# EAGLE design day-led-r1 (EAGLE 6.5.0)
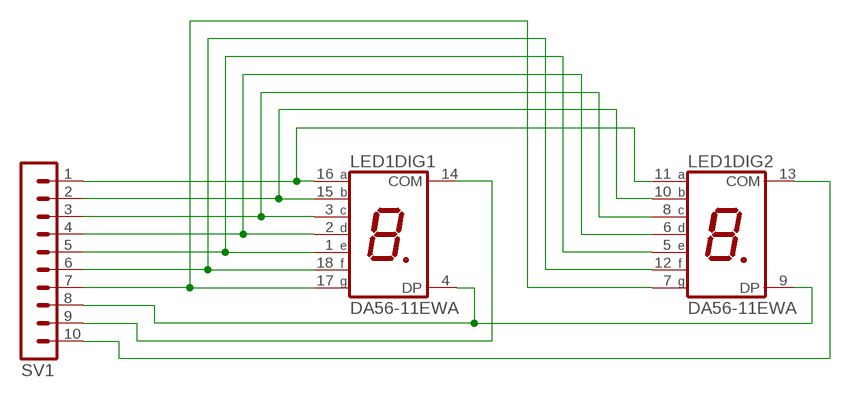
[diagram p0: schematic, sheet 1]

## Parts
LED1  DA56-11EWA  [DA56]
SV1  MA10-1W  [MA10-1W]

## Nets
N$1: LED1.11(DIG2:A) LED1.16(DIG1:A) SV1.1
N$2: LED1.10(DIG2:B) LED1.15(DIG1:B) SV1.2
N$3: LED1.3(DIG1:C) LED1.8(DIG2:C) SV1.3
N$4: LED1.2(DIG1:D) LED1.6(DIG2:D) SV1.4
N$5: LED1.1(DIG1:E) LED1.5(DIG2:E) SV1.5
N$6: LED1.12(DIG2:F) LED1.18(DIG1:F) SV1.6
N$7: LED1.7(DIG2:G) LED1.17(DIG1:G) SV1.7
N$8: LED1.4(DIG1:DP) LED1.9(DIG2:DP) SV1.8
N$17: LED1.13(DIG2:COM) SV1.10
N$20: LED1.14(DIG1:COM) SV1.9

## Library data of the parts
LED1 = display-kingbright:DA56-11: 14.22mm (0.56INCH) DUAL DIGIT NUMERIC DISPLAYS Source: www.kingbright.com .. DA56-11SRWA.pdf; OC_FARNELL: unknown; OC_NEWARK: unknown
SV1 = con-lstb:MA10-1W: PIN HEADER; OC_FARNELL: unknown; OC_NEWARK: unknown

## Board
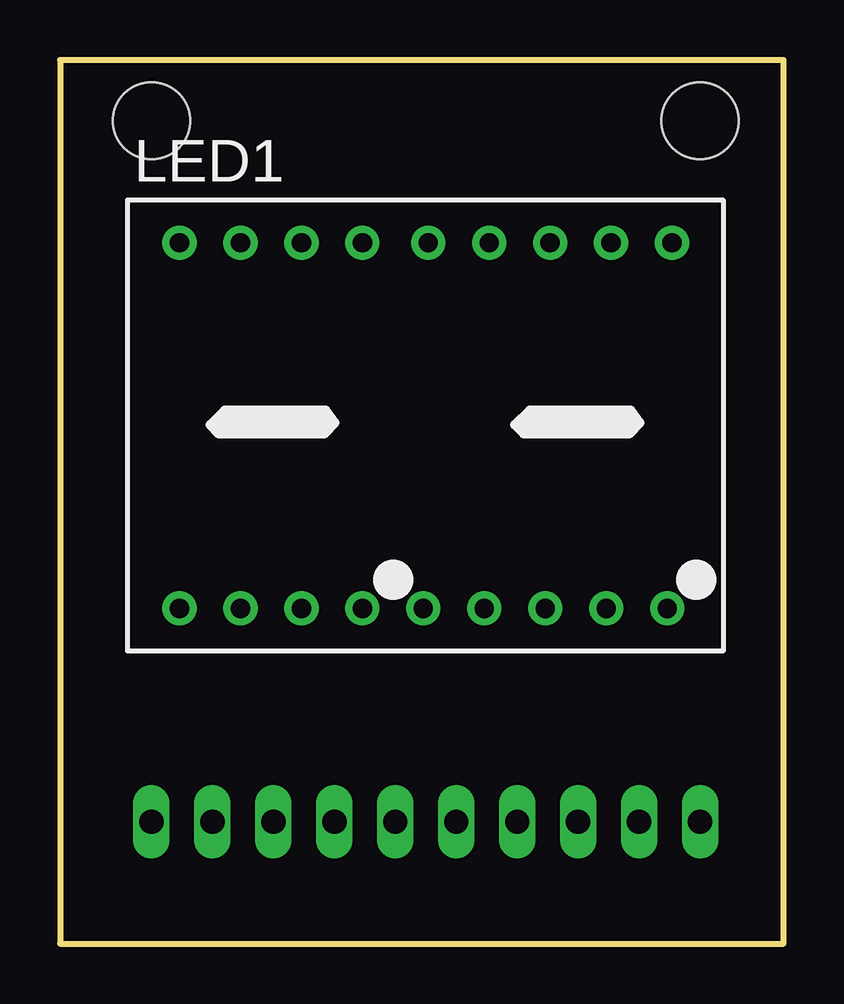
[diagram p1: board, top side]
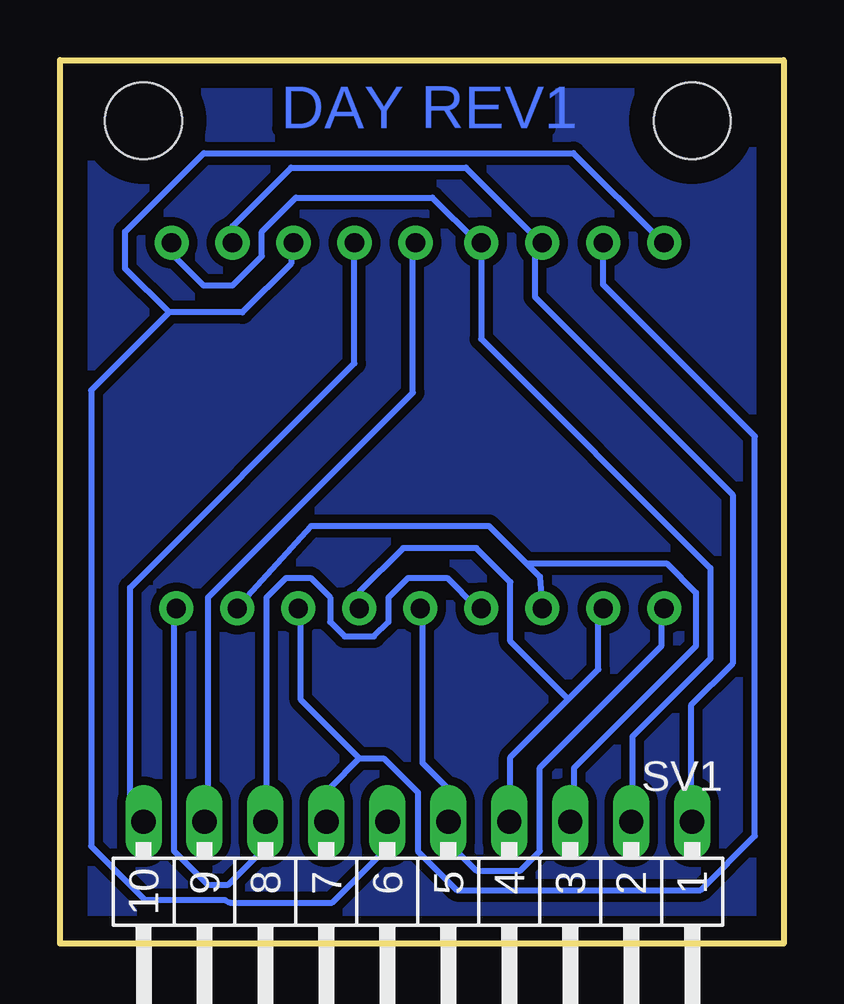
[diagram p2: board, bottom side, seen from below]

Size 30.15 x 36.82 mm. Coordinates in mm from the lower left corner, seen from the top.
Outline: 0,0 30.15,0 30.15,36.82 0,36.82 0,0
Copper layers (1*16): Top 0.035mm / dielectric 1.5mm / Bottom 0.035mm
Design rules "default *": minimum track width 10mil, minimum drill 24mil, track to track 14mil, track to pad 14mil, pad to pad 14mil, via to via 14mil, smd to smd 14mil, copper to edge 40mil, drill to drill 8mil, minimum pad ring 10mil, minimum via ring 8mil, stop-mask expansion 4mil, vias tented up to drill 0mil, thermal gap 10mil
Holes 3.2 mm at 3.81,34.29 26.67,34.29

### Footprints (pad centres in the part's own frame; a part is rotated, then mirrored left to right if it is on the bottom)
DA56 = drill 0.8 pad 1.422: 1 -10.26,-7.62; 2 -7.72,-7.62; 3 -5.18,-7.62; 4 -2.64,-7.62; 5 -0.1,-7.62; 6 2.44,-7.62; 7 4.98,-7.62; 8 7.52,-7.62; 9 10.06,-7.62; 10 10.26,7.62; 11 7.72,7.62; 12 5.18,7.62; 13 2.64,7.62; 14 0.1,7.62; 15 -2.64,7.62; 16 -5.18,7.62; 17 -7.72,7.62; 18 -10.26,7.62
MA10-1W = drill 1.016 long: 1 -11.43,0; 2 -8.89,0; 3 -6.35,0; 4 -3.81,0; 5 -1.27,0; 6 1.27,0; 7 3.81,0; 8 6.35,0; 9 8.89,0; 10 11.43,0

### Placement (x,y rotation side)
LED1  15.24,21.59 0 top
SV1  15.24,5.08 180 bottom

### Tracks (layer width: path | path; a pad name or v marks a point on that pad's centre or on a via)
N$1
  Bottom 0.254: 10.36,29.46 13.23,32.33 20.52,32.33 22.96,29.9 LED1.11 | 10.36,29.46 10.16,29.26 LED1.16 10.36,29.46 | 10.36,29.46 10.36,26.95 2.12,18.71 2.12,11.67 3.86,9.93 3.86,5.08 SV1.1
N$2
  Bottom 0.254: LED1.10 25.4,29.06 25.4,28.65 24.18,27.43 22.96,27.43 21.74,28.65 21.74,29.67 20.32,31.09 14.63,31.09 12.8,29.26 LED1.15 12.6,29.06 12.6,25.2 3.05,15.65 3.05,11.87 6.3,8.62 6.3,5.08 SV1.2
N$3
  Bottom 0.254: 10.72,15.85 12.28,17.41 19.68,17.41 22.76,14.02 LED1.8 | 10.72,15.85 10.16,15.29 LED1.3 | 10.72,15.85 4.88,15.85 3.66,14.63 3.66,12.39 8.74,7.32 8.74,5.08 SV1.3
N$4
  Bottom 0.254: 8.97,10.19 11.38,7.77 11.38,5.08 SV1.4 | 8.97,10.19 7.72,11.43 7.72,13.82 LED1.2 | 8.97,10.19 11.38,12.6 11.38,15.06 12.8,16.48 15.85,16.48 17.68,14.66 LED1.6
N$5
  Bottom 0.254: LED1.1 5.08,13.82 5.08,12.42 10.16,7.34 10.16,3.86 10.97,3.05 12.8,3.05 13.82,4.06 13.82,5.08 SV1.5 14.02,5.08 14.02,6.5 15.04,7.52 15.04,13.82 LED1.5
N$6
  Bottom 0.254: 25.6,26.3 27.43,28.13 27.43,29.67 24.16,32.94 8.76,32.94 5.08,29.26 LED1.18 | 25.6,26.3 22.55,26.3 20.52,28.33 20.52,29.06 LED1.12 | 25.6,26.3 28.85,23.05 28.85,4.06 26.62,1.83 23.28,1.83 23.08,1.71 18.81,1.71 16.66,3.86 16.66,5.08 SV1.6
N$7
  Bottom 0.254: 17.68,7.72 16.66,7.72 15.24,6.3 15.24,3.86 13.61,2.23 3.45,2.23 1.19,4.5 1.19,21.13 7.52,27.46 7.52,29.06 LED1.17 | 17.68,7.72 18.9,6.5 18.9,5.08 SV1.7 | 17.68,7.72 20.12,10.16 20.12,13.82 LED1.7
N$8
  Bottom 0.254: LED1.4 12.8,14.02 14.02,15.24 15.65,15.24 16.46,14.43 16.46,13.41 17.07,12.8 18.29,12.8 18.9,13.41 18.9,14.43 19.71,15.24 20.73,15.24 21.54,14.43 21.54,5.08 SV1.8 21.74,5.08 21.74,3.86 23.16,2.44 23.98,2.44 25.4,3.86 25.4,13.82 LED1.9
N$17
  Bottom 0.254: LED1.13 17.88,29.06 17.88,24.18 27.23,14.83 27.23,5.49 26.82,5.08 SV1.10
N$18
  pour Bottom: 0,36.83 30.48,36.83 30.48,0 0,0
N$20
  Bottom 0.254: LED1.14 15.44,29.06 15.44,22.96 23.98,14.43 23.98,5.08 SV1.9

### Text on the board
Bottom: DAY REV1